# EAGLE design SparkFun_ProDriver_TC78H670FTG (EAGLE 9.6.2)
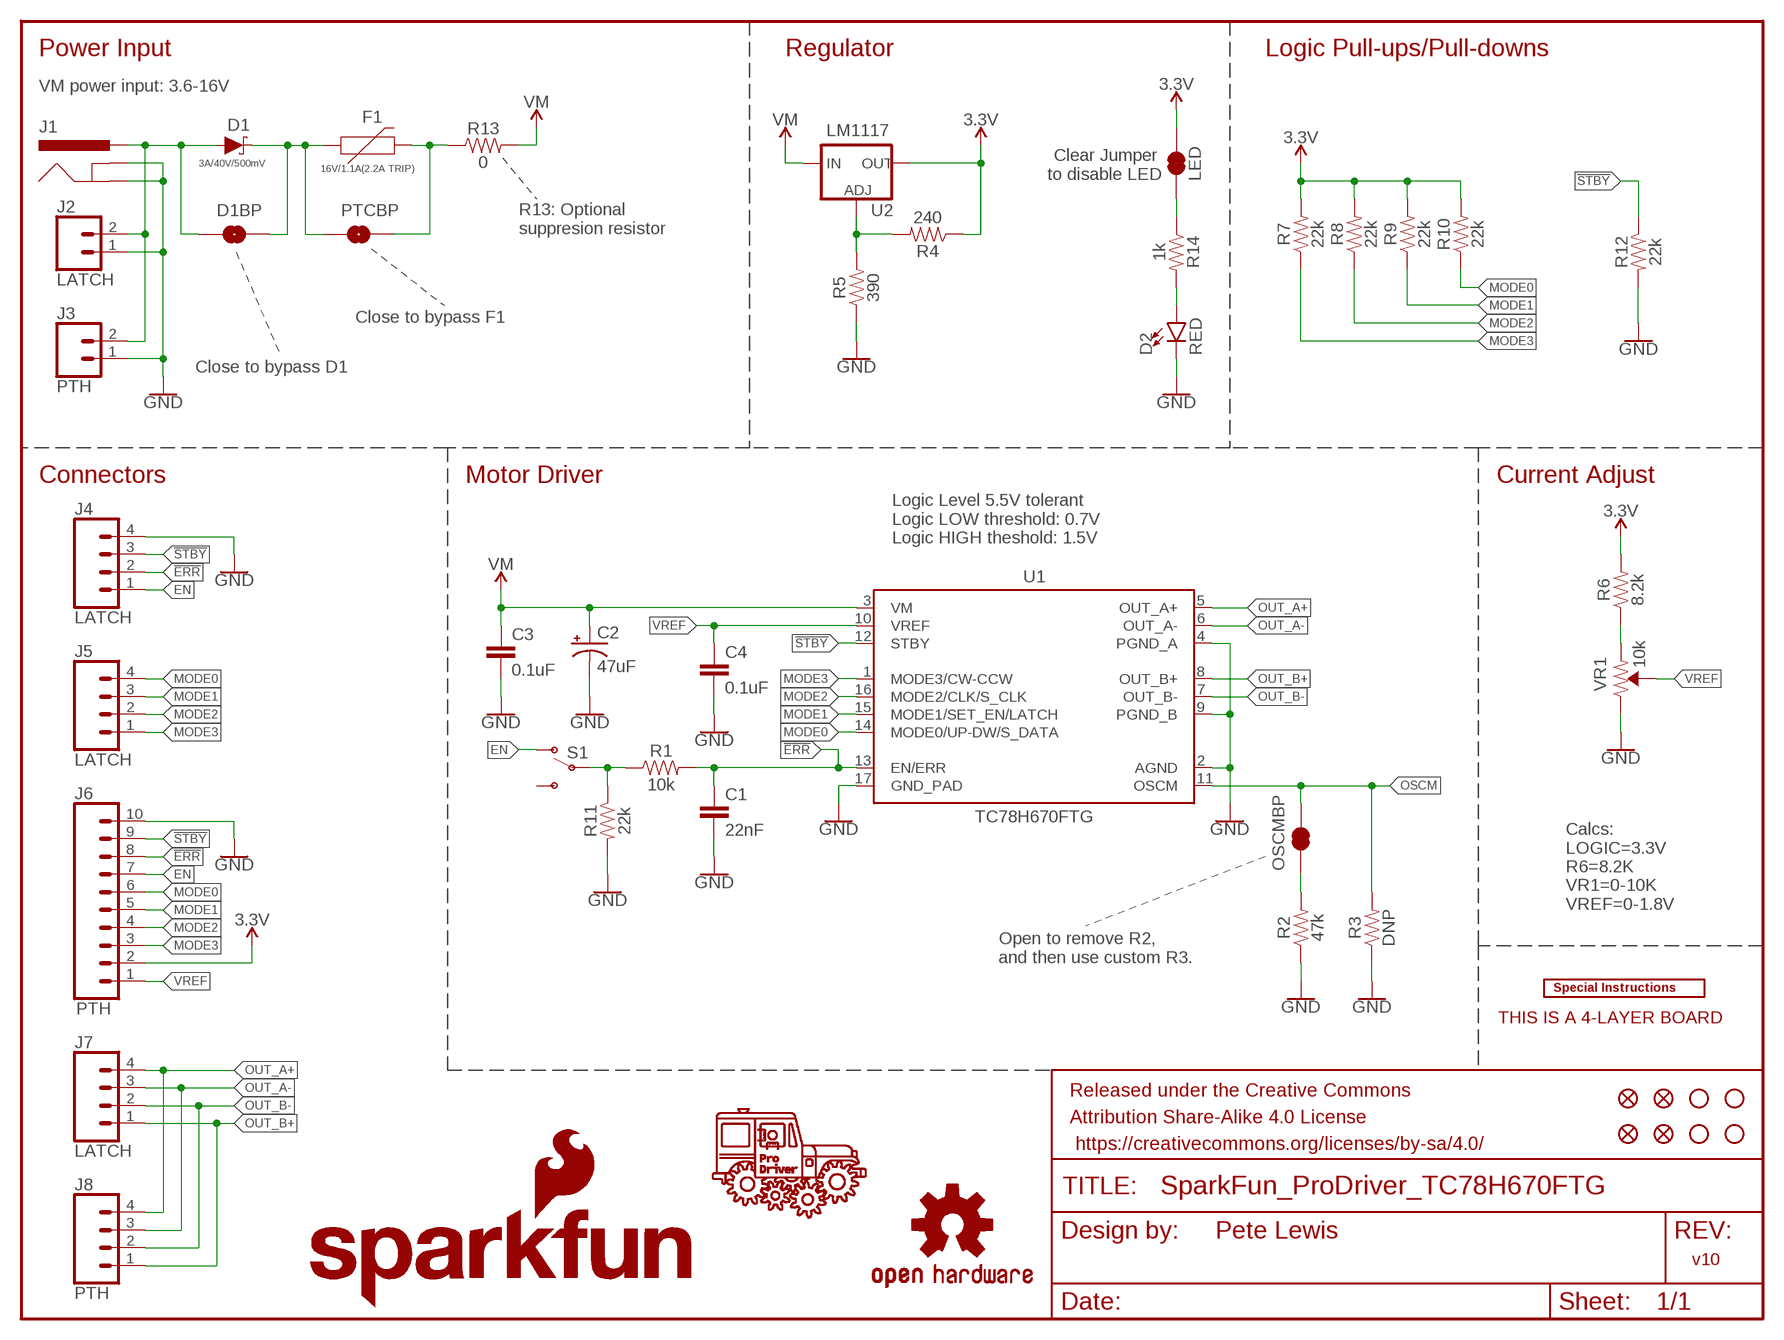
[diagram p0: schematic, sheet 1]

## Parts
C1  22nF  22NF/22,000PF-0603-50V-10%  [0603]
C2  47uF  47UF-POLAR-PANASONIC_D-35V-20%  [PANASONIC_D]
C3  0.1uF  0.1UF-0603-25V-(+80/-20%)  [0603]
C4  0.1uF  0.1UF-0603-25V-(+80/-20%)  [0603]
D1  3A/40V/500mV  DIODE-SCHOTTKY-B340A  [SMA-DIODE]
D1BP  JUMPER-SMT_2_NO_SILK  [SMT-JUMPER_2_NO_SILK]
D2  RED  LED-RED0603  [LED-0603]
F1  16V/1.1A(2.2A TRIP)  PPTC_16V_1.1A_(2.2ATRIP)  [1210]
FID1  FIDUCIAL1X2  [FIDUCIAL-1X2]
FID2  FIDUCIAL1X2  [FIDUCIAL-1X2]
FID3  FIDUCIAL1X2  [FIDUCIAL-1X2]
FID4  FIDUCIAL1X2  [FIDUCIAL-1X2]
FRAME1  FRAME-LETTER  [CREATIVE_COMMONS]
J1  POWER_JACKTOE  [POWER_JACK_SMD_OVERPASTE_TOE]
J2  LATCH  CONN_02LATCH_2  [LATCHTERMINAL-5MM-2]
J3  PTH  CONN_021X02_NO_SILK  [1X02_NO_SILK]
J4  LATCH  CONN_04LATCH  [LATCHTERMINAL-5MM-4]
J5  LATCH  CONN_04LATCH  [LATCHTERMINAL-5MM-4]
J6  PTH  CONN_10NO_SILK_PTH_FEMALE  [1X10_NO_SILK]
J7  LATCH  CONN_04LATCH  [LATCHTERMINAL-5MM-4]
J8  PTH  CONN_041X04_NO_SILK  [1X04_NO_SILK]
JP4  LED  JUMPER-SMT_2_NC_TRACE_SILK  [SMT-JUMPER_2_NC_TRACE_SILK]
LOGO1  SFE_LOGO_NAME_FLAME.1_INCH  [SFE_LOGO_NAME_FLAME_.1]
LOGO2  OSHW-LOGOS  [OSHW-LOGO-S]
LOGO3  SPECIAL_INSTRUCTIONS-ORDERING  [ORDERING_INSTRUCTIONS]
OSCMBP  JUMPER-SMT_2_NC_TRACE_SILK  [SMT-JUMPER_2_NC_TRACE_SILK]
PTCBP  JUMPER-SMT_2_NO_SILK  [SMT-JUMPER_2_NO_SILK]
R1  10k  10KOHM-0603-1/10W-1%  [0603]
R2  47k  47KOHM-0603-1/10W-1%  [0603]
R3  DNP  RESISTORAXIAL-0.3  [AXIAL-0.3]
R4  240  240OHM-0603-1/10W-1%  [0603]
R5  390  390OHM-0603-1/10W-1%  [0603]
R6  8.2k  8.2KOHM-0603-1/10W-5%  [0603]
R7  22k  22KOHM-0603-1/10W-1%  [0603]
R8  22k  22KOHM-0603-1/10W-1%  [0603]
R9  22k  22KOHM-0603-1/10W-1%  [0603]
R10  22k  22KOHM-0603-1/10W-1%  [0603]
R11  22k  22KOHM-0603-1/10W-1%  [0603]
R12  22k  22KOHM-0603-1/10W-1%  [0603]
R13  0  0OHM-0603-1/10W-5%  [0603]
R14  1k  1KOHM-0603-1/10W-1%  [0603]
S1  SWITCH-SPDT-PTH-11.6X4.0MM-LOCK  [SWITCH_SPDT_PTH_11.6X4.0MM_LOCK]
STANDOFF1  STAND-OFF  [STAND-OFF]
STANDOFF2  STAND-OFF  [STAND-OFF]
STANDOFF3  STAND-OFF  [STAND-OFF]
STANDOFF4  STAND-OFF  [STAND-OFF]
U1  TC78H670FTG  [P-VQFN16-0303-0.50-001]
U2  LM1117  V_REG_LM1117SOT223  [SOT223]
U$41  PRODRIVER_LOGO  [PRODRIVER_LOGO]
VR1  10k  TRIMPOT-SMD-3MM-CLOSED-1/8W-20%  [TRIMPOT-SMD-3MM-CLOSED]

## Nets
3.3V: J6.2 JP4.2 R4.1 R6.2 R7.2 R8.2 R9.2 R10.2 U2.2(OUT) U2.4(OUT)
!ERR: C1.1 J4.2 J6.8 R1.2 U1.13(EN/ERR)
!STBY: J4.3 J6.9 R12.1 U1.12(STBY)
EN: J4.1 J6.7 S1.1(O)
GND: C1.2 C2.- C3.2 C4.2 D2.C J1.GND(GNDBREAK) J1.P$4(GND) J2.1 J3.1 J4.4 J6.10 R2.1 R3.P$1 R5.1 R11.2 R12.2 U1.2(AGND) U1.4(PGND_A) U1.9(PGND_B) U1.17(GND_PAD) VR1.3(CW)
MODE0: J5.4 J6.6 R10.1 U1.14(MODE0/UP-DW/S_DATA)
MODE1: J5.3 J6.5 R9.1 U1.15(MODE1/SET_EN/LATCH)
MODE2: J5.2 J6.4 R8.1 U1.16(MODE2/CLK/S_CLK)
MODE3: J5.1 J6.3 R7.1 U1.1(MODE3/CW-CCW)
N$1: D1.C D1BP.2 F1.1 PTCBP.1
N$2: OSCMBP.1 R2.2
N$3: F1.2 PTCBP.2 R13.1
N$4: R4.2 R5.2 U2.1(ADJ)
N$5: R6.1 VR1.1(CCW)
N$6: D2.A R14.2
N$7: R1.1 R11.1 S1.2(P)
N$8: JP4.1 R14.1
OSCM: OSCMBP.2 R3.P$2 U1.11(OSCM)
OUT_A+: J7.4 J8.4 U1.5(OUT_A+)
OUT_A-: J7.3 J8.3 U1.6(OUT_A-)
OUT_B+: J7.1 J8.1 U1.8(OUT_B+)
OUT_B-: J7.2 J8.2 U1.7(OUT_B-)
RAW: D1.A D1BP.1 J1.VIN0(PWR) J2.2 J3.2
VM: C2.+ C3.1 R13.2 U1.3(VM) U2.3(IN)
VREF: C4.1 J6.1 U1.10(VREF) VR1.2(WIPER)
Unconnected: S1.3(S)

## Notes on the sheet
- Power Input | Regulator | Logic Pull-ups/Pull-downs
- VM power input: 3.6-16V
- Clear Jumper 
  to disable LED
- R13: Optional
  suppresion resistor
- Close to bypass F1
- Close to bypass D1
- Connectors | Motor Driver | Current Adjust
- Logic Level 5.5V tolerant
  Logic LOW threshold: 0.7V
  Logic HIGH theshold: 1.5V
- Calcs:
  LOGIC=3.3V
  R6=8.2K
  VR1=0-10K
  VREF=0-1.8V
- Open to remove R2,
  and then use custom R3.
- THIS IS A 4-LAYER BOARD
- Pete Lewis
- v10

## Library data of the parts
C1 = SparkFun-Capacitors:22NF/22,000PF: 0.022uF/22nF/22,000pF ceramic capacitors A capacitor is a passive two-terminal electrical component used to store electrical energy temporarily in an electric field.; PROD_ID: CAP-07885
C2 = SparkFun-Capacitors:47UF-POLAR: 47µF polarized capacitors A capacitor is a passive two-terminal electrical component used to store electrical energy temporarily in an electric field.; PROD_ID: CAP-08478
C3 C4 = SparkFun-Capacitors:0.1UF: 0.1µF ceramic capacitors A capacitor is a passive two-terminal electrical component used to store electrical energy temporarily in an electric field.; PROD_ID: CAP-00810
D1 = SparkFun-DiscreteSemi:DIODE-SCHOTTKY: Schottky diode A Schottky diode is a semiconductor diode which has a low forward voltage drop and a very fast switching action.; PROD_ID: DIO-09886
D1BP PTCBP = SparkFun-Jumpers:JUMPER-SMT_2_NO: Normally open jumper This jumper has two pads in close proximity to each other. Apply solder to close the connection. Round pads are easier to solder for beginners, but are a lot larger. SparkFun Product that uses the round pads: SparkFun EL Sequencer <https://www.sparkfun.com/products/12781>
D2 = SparkFun-LED:LED-RED: Red SMD LED Used in manufacturing of most products at SparkFun Packages: 0603 - SMD 0603 package [Product Link] <http://docs.avagotech.com/docs/AV02-0551EN> 0603 SMART - SMD 0603 SMART package ( more efficient and expensive)[Product Link] <http://www.osram-os.com/Graphics/XPic2/00077099_0.pdf> 1206 - SMD1206 package [Product Link] <https://www.sparkfun.com/datasheets/DevTools/LilyPad/Q150OVS4.pdff> SparkFun Products: Pro Mini 328 -5V <https://www.sparkfun.com/products/821> RedBoard <https://www.sparkfun.com/products/12757> IOIO-OTG <https://www.sparkfun.com/products/13613>; PROD_ID: DIO-00819
F1 = TC78H670FTG:PPTC: Resettable Fuse PPTC Resettable Fuse. Really a sort of resistor with a polymeric positive temperature coefficient whose resistance increases dramatically with an increase in temperature. When heated by the power passing through the resistance rises causing the current to be limited, protecting the circuit. This is achieved by the transition of the polymer from a crystalline to an amorphous state where the conductive carbon separates breaking the conductive pathways found in the cool crystalline structure. When a PPTC cools back down it resumes conducting letting the circuit turn back on. SparkFun Products: SparkFun RedBoard - Programmed with Arduino <https://www.sparkfun.com/products/12757> Pro Micro - 5V/16MHz <https://www.sparkfun.com/products/12640> Arduino Pro 328 - 5V/16MHz <https://www.sparkfun.com/products/10915> MP3 Trigger <https://www.sparkfun.com/products/13720>; PROD_ID: RES-15179
FID1-FID4 = SparkFun-Aesthetics:FIDUCIAL: Fiducial Alignment Points Point-of-reference for pick-and-place machines and other optical instruments.
FRAME1 = SparkFun-Aesthetics:FRAME-LETTER: Schematic Frame - Letter Standard 8.5x11 US Letter frame
J1 = SparkFun-Connectors:POWER_JACK: Power Jack Connector This is the standard 5.5mm barrel jack for power. The PTH is the most common, proven, reliable, footprint. The Slot footprint only works if the mill layer is transmitted to the PCB fab house so be warned. Here are the connectors we sell at SparkFun: DC Barrel Power Jack/Connector <https://www.sparkfun.com/products/119> (PRT-00119) DC Barrel Power Jack/Connector (SMD) <https://www.sparkfun.com/products/12748> (PRT-12748) DC Barrel Jack Adapter - Breadboard Compatible <https://www.sparkfun.com/products/10811> (PRT-10811) It is used on this SparkFun product (and many, many others): SparkFun RedBoard - Programmed with Arduino <https://www.sparkfun.com/products/12757> (DEV-12757) Also, if you need a mating power supply or connector, please check these out: Wall Adapter Power Supply - 9VDC 650mA <https://www.sparkfun.com/products/298> (TOL-00298) DC Barrel Jack Adapter - Male <https://www.sparkfun.com/products/10287> (PRT-10287); PROD_ID: CONN-08106; SF_ID: PRT-12748
J2 = SparkFun-Connectors:CONN_02: Multi connection point. Often used as Generic Header-pin footprint for 0.1 inch spaced/style header connections On any of the 0.1 inch spaced packages, you can populate with these: Break Away Headers - Straight <https://www.sparkfun.com/products/116> (PRT-00116) Break Away Male Headers - Right Angle <https://www.sparkfun.com/products/553> (PRT-00553) Female Headers <https://www.sparkfun.com/products/115> (PRT-00115) Break Away Headers - Machine Pin <https://www.sparkfun.com/products/117> (PRT-00117) Break Away Female Headers - Swiss Machine Pin <https://www.sparkfun.com/products/743> (PRT-00743) For SCREWTERMINALS and SPRING TERMINALS visit here: Screw Terimnals on SparkFun.com <https://www.sparkfun.com/search/results?term=Screw+Terminals> (5mm/3.5mm/2.54mm spacing) This device is also useful as a general connection point to wire up your design to another part of your project. Our various solder wires solder well into these plated through hole pads. Hook-Up Wire - Assortment (Stranded, 22 AWG) <https://www.sparkfun.com/products/11375> (PRT-11375) Hook-Up Wire - Assortment (Solid Core, 22 AWG) <https://www.sparkfun.com/products/11367> (PRT-11367) View the entire wire category on our website here <https://www.sparkfun.com/categories/141> Special notes: Molex polarized connector foot print use with: PRT-08233 with associated crimp pins and housings. 2.54_SCREWTERM for use with PRT-10571. 3.5mm Screw Terminal footprints for PRT-08084 5mm Screw Terminal footprints for use with PRT-08432; PROD_ID: CONN-14720; STOREFRONT_SKU: PRT-15898
J3 = SparkFun-Connectors:CONN_02: Multi connection point. Often used as Generic Header-pin footprint for 0.1 inch spaced/style header connections On any of the 0.1 inch spaced packages, you can populate with these: Break Away Headers - Straight <https://www.sparkfun.com/products/116> (PRT-00116) Break Away Male Headers - Right Angle <https://www.sparkfun.com/products/553> (PRT-00553) Female Headers <https://www.sparkfun.com/products/115> (PRT-00115) Break Away Headers - Machine Pin <https://www.sparkfun.com/products/117> (PRT-00117) Break Away Female Headers - Swiss Machine Pin <https://www.sparkfun.com/products/743> (PRT-00743) For SCREWTERMINALS and SPRING TERMINALS visit here: Screw Terimnals on SparkFun.com <https://www.sparkfun.com/search/results?term=Screw+Terminals> (5mm/3.5mm/2.54mm spacing) This device is also useful as a general connection point to wire up your design to another part of your project. Our various solder wires solder well into these plated through hole pads. Hook-Up Wire - Assortment (Stranded, 22 AWG) <https://www.sparkfun.com/products/11375> (PRT-11375) Hook-Up Wire - Assortment (Solid Core, 22 AWG) <https://www.sparkfun.com/products/11367> (PRT-11367) View the entire wire category on our website here <https://www.sparkfun.com/categories/141> Special notes: Molex polarized connector foot print use with: PRT-08233 with associated crimp pins and housings. 2.54_SCREWTERM for use with PRT-10571. 3.5mm Screw Terminal footprints for PRT-08084 5mm Screw Terminal footprints for use with PRT-08432
J4 J5 J7 = SparkFun-Connectors:CONN_04: Multi connection point. Often used as Generic Header-pin footprint for 0.1 inch spaced/style header connections On any of the 0.1 inch spaced packages, you can populate with these: Break Away Headers - Straight <https://www.sparkfun.com/products/116> (PRT-00116) Break Away Male Headers - Right Angle <https://www.sparkfun.com/products/553> (PRT-00553) Female Headers <https://www.sparkfun.com/products/115> (PRT-00115) Break Away Headers - Machine Pin <https://www.sparkfun.com/products/117> (PRT-00117) Break Away Female Headers - Swiss Machine Pin <https://www.sparkfun.com/products/743> (PRT-00743) For SCREWTERMINALS and SPRING TERMINALS visit here: Screw Terimnals on SparkFun.com <https://www.sparkfun.com/search/results?term=Screw+Terminals> (5mm/3.5mm/2.54mm spacing) This device is also useful as a general connection point to wire up your design to another part of your project. Our various solder wires solder well into these plated through hole pads. Hook-Up Wire - Assortment (Stranded, 22 AWG) <https://www.sparkfun.com/products/11375> (PRT-11375) Hook-Up Wire - Assortment (Solid Core, 22 AWG) <https://www.sparkfun.com/products/11367> (PRT-11367) View the entire wire category on our website here <https://www.sparkfun.com/categories/141> Special notes: Molex polarized connector foot print use with SKU : PRT-08231 with associated crimp pins and housings. 1MM SMD Version SKU: PRT-10208; PROD_ID: CONN-14722; STOREFRONT_SKU: PRT-15900
J6 = SparkFun-Connectors:CONN_10: Multi connection point. Often used as Generic Header-pin footprint for 0.1 inch spaced/style header connections On any of the 0.1 inch spaced packages, you can populate with these: Break Away Headers - Straight <https://www.sparkfun.com/products/116> (PRT-00116) Break Away Male Headers - Right Angle <https://www.sparkfun.com/products/553> (PRT-00553) Female Headers <https://www.sparkfun.com/products/115> (PRT-00115) Break Away Headers - Machine Pin <https://www.sparkfun.com/products/117> (PRT-00117) Break Away Female Headers - Swiss Machine Pin <https://www.sparkfun.com/products/743> (PRT-00743) Arduino Stackable Header - 10 Pin <https://www.sparkfun.com/products/11376> (PRT-11376) For SCREWTERMINALS and SPRING TERMINALS visit here: Screw Terimnals on SparkFun.com <https://www.sparkfun.com/search/results?term=Screw+Terminals> (5mm/3.5mm/2.54mm spacing) This device is also useful as a general connection point to wire up your design to another part of your project. Our various solder wires solder well into these plated through hole pads. Hook-Up Wire - Assortment (Stranded, 22 AWG) <https://www.sparkfun.com/products/11375> (PRT-11375) Hook-Up Wire - Assortment (Solid Core, 22 AWG) <https://www.sparkfun.com/products/11367> (PRT-11367) View the entire wire category on our website here <https://www.sparkfun.com/categories/141> Special notes: Molex polarized connector foot print use with SKU : PRT-08231 with associated crimp pins and housings. 1MM SMD Version SKU: PRT-10208 NOTES ON THE VARIANTS LOCK and LOCK_LONGPADS... This footprint was designed to help hold the alignment of a through-hole component (i.e. 6-pin header) while soldering it into place. You may notice that each hole has been shifted either up or down by 0.005 of an inch from it's more standard position (which is a perfectly straight line). This slight alteration caused the pins (the squares in the middle) to touch the edges of the holes. Because they are alternating, it causes a "brace" to hold the component in place. 0.005 has proven to be the perfect amount of "off-center" position when using our standard breakaway headers. Although looks a little odd when you look at the bare footprint, once you have a header in there, the alteration is very hard to notice. Also,if you push a header all the way into place, it is covered up entirely on the bottom side.
J8 = SparkFun-Connectors:CONN_04: Multi connection point. Often used as Generic Header-pin footprint for 0.1 inch spaced/style header connections On any of the 0.1 inch spaced packages, you can populate with these: Break Away Headers - Straight <https://www.sparkfun.com/products/116> (PRT-00116) Break Away Male Headers - Right Angle <https://www.sparkfun.com/products/553> (PRT-00553) Female Headers <https://www.sparkfun.com/products/115> (PRT-00115) Break Away Headers - Machine Pin <https://www.sparkfun.com/products/117> (PRT-00117) Break Away Female Headers - Swiss Machine Pin <https://www.sparkfun.com/products/743> (PRT-00743) For SCREWTERMINALS and SPRING TERMINALS visit here: Screw Terimnals on SparkFun.com <https://www.sparkfun.com/search/results?term=Screw+Terminals> (5mm/3.5mm/2.54mm spacing) This device is also useful as a general connection point to wire up your design to another part of your project. Our various solder wires solder well into these plated through hole pads. Hook-Up Wire - Assortment (Stranded, 22 AWG) <https://www.sparkfun.com/products/11375> (PRT-11375) Hook-Up Wire - Assortment (Solid Core, 22 AWG) <https://www.sparkfun.com/products/11367> (PRT-11367) View the entire wire category on our website here <https://www.sparkfun.com/categories/141> Special notes: Molex polarized connector foot print use with SKU : PRT-08231 with associated crimp pins and housings. 1MM SMD Version SKU: PRT-10208; PROD_ID: CONN-09696
JP4 OSCMBP = SparkFun-Jumpers:JUMPER-SMT_2_NC_TRACE: Normally closed trace jumper This jumper has a trace between two pads so it's normally closed (NC). Use a razor knife to open the connection. For best results follow the IPC guidelines for cutting traces: Cutout at least 0.063 mm (0.005 in). Remove all loose material to clean up the cut area. Seal the cut with an approved epoxy. Reapply solder to reclose the connection.
LOGO1 = SparkFun-Aesthetics:SFE_LOGO_NAME_FLAME: SparkFun Font Logo w/ Flame This is the SparkFun full logo. The logo on the schematic will always be the same size; the package variant is the height of the flame part of the logo. Default layer for the logo on the board is tSilk.
LOGO2 = SparkFun-Aesthetics:OSHW-LOGO: Open-Source Hardware (OSHW) Logo This logo indicates the piece of hardware it is found on incorporates a OSHW license and/or adheres to the definition of open source hardware found here: http://freedomdefined.org/OSHW
LOGO3 = SparkFun-Aesthetics:SPECIAL_INSTRUCTIONS: Special Ordering/Production Instructions Alert Symbol for special PCB ordering instructions or unique production process warnings. Ordering Instructions Production Instructions Types of information that should be added to box: Copper weight Soldermask color Silk color PCB thickness Number of layers PCB Standard: 1.6mm FR4 1 oz copper immersion silver plating red soldermask white silkscreen Types of information that should be added to box: Special wash requirements Depaneling instructions Humidification Glue curing Default text settings: 0.07 inch 9% ratio 50% line distance
R1 = SparkFun-Resistors:10KOHM: 10kΩ resistor A resistor is a passive two-terminal electrical component that implements electrical resistance as a circuit element. Resistors act to reduce current flow, and, at the same time, act to lower voltage levels within circuits. - Wikipedia; PROD_ID: RES-00824
R2 = SparkFun-Resistors:47KOHM: 47kΩ resistor A resistor is a passive two-terminal electrical component that implements electrical resistance as a circuit element. Resistors act to reduce current flow, and, at the same time, act to lower voltage levels within circuits. - Wikipedia; PROD_ID: RES-07871
R3 = SparkFun-Resistors:RESISTOR: Generic Resistor Package
R4 = SparkFun-Resistors:240OHM: 240Ω resistor A resistor is a passive two-terminal electrical component that implements electrical resistance as a circuit element. Resistors act to reduce current flow, and, at the same time, act to lower voltage levels within circuits. - Wikipedia; PROD_ID: RES-07849
R5 = SparkFun-Resistors:390OHM: 390Ω resistor A resistor is a passive two-terminal electrical component that implements electrical resistance as a circuit element. Resistors act to reduce current flow, and, at the same time, act to lower voltage levels within circuits. - Wikipedia; PROD_ID: RES-07864
R6 = SparkFun-Resistors:8.2KOHM: 8.2kΩ resistor A resistor is a passive two-terminal electrical component that implements electrical resistance as a circuit element. Resistors act to reduce current flow, and, at the same time, act to lower voltage levels within circuits. - Wikipedia; PROD_ID: RES-10646
R7-R12 = SparkFun-Resistors:22KOHM: 22kΩ resistor A resistor is a passive two-terminal electrical component that implements electrical resistance as a circuit element. Resistors act to reduce current flow, and, at the same time, act to lower voltage levels within circuits. - Wikipedia; PROD_ID: RES-07853
R13 = SparkFun-Resistors:0OHM: 0Ω resistor A resistor is a passive two-terminal electrical component that implements electrical resistance as a circuit element. Resistors act to reduce current flow, and, at the same time, act to lower voltage levels within circuits. - Wikipedia; PROD_ID: RES-08609
R14 = SparkFun-Resistors:1KOHM: 1kΩ resistor A resistor is a passive two-terminal electrical component that implements electrical resistance as a circuit element. Resistors act to reduce current flow, and, at the same time, act to lower voltage levels within circuits. - Wikipedia; PROD_ID: RES-07856
S1 = SparkFun-Switches:SWITCH-SPDT: Single Pole, Double Throw (SPDT) Switch Single-pole, double-throw (SPDT) switch. Variant Overview SMD-AYZ0202 Surface Mount DPDT Switch <https://www.sparkfun.com/products/597> (COM-00597) Used on e.g. LilyPad Arduino USB - ATmega32U4 Board <https://www.sparkfun.com/products/12049> PTH-11.6X4.0MM SPDT Mini Power Switch <https://www.sparkfun.com/products/102> (COM-00102) Used on e.g. SparkFun Simon Says - Through-Hole Soldering Kit <https://www.sparkfun.com/products/10547> (KIT-10547) PTH-11.6X4.0MM-KIT KIT version of SPDT Mini Power Switch - Simplifies soldering by removing tStop of switch pins - only one side can be soldered. PTH-11.6X4.0MM-LOCK LOCK version of SPDT Mini Power Switch - Offset pins hold switch in place for easier soldering. SMD-RIGHT-ANGLE Surface Mount Right Angle Switch <https://www.sparkfun.com/products/10860> (COM-10860) Used on e.g. SparkFun ESP8266 Thing <https://www.sparkfun.com/products/13231>; PROD_ID: SWCH-08261; SF_SKU: COM-00102
STANDOFF1-STANDOFF4 = SparkFun-Electromechanical:STAND-OFF: #4 Stand Off This is the mechanical footprint for a #4 phillips button head screw. Use the keepout ring to avoid running the screw head into surrounding components. SKU : PRT-00447
U1 = SparkFun-IC-Special-Function:TC78H670FTG: Toshiba TC78H670FTG Stepper Motor Driver Clock-in and Serial controlled Bipolar Stepping Motor Driver Datasheet <https://cdn.sparkfun.com/assets/9/9/6/d/1/TC78H670FTG_datasheet.pdf> SparkFun Products: SparkFun ProDriver - Stepper Motor Driver (TC78H670FTG) <https://www.sparkfun.com/products/16836> <https://www.sparkfun.com/products/16836>; PROD_ID: IC-15170
U2 = SparkFun-IC-Power:V_REG_LM1117: Voltage Regulator LM1117 Standard adjustable voltage regulator but in SMD form. Spark Fun Electronics SKU : COM-00595; PROD_ID: VREG-08170
U$41 = TC78H670FTG:PRODRIVER_LOGO
VR1 = SparkFun-Resistors:TRIMPOT: Trimming Potentiometer (Trimpot) Three-terminal potentiometers, with an adjustable wiper and two adjustable resistors. A pot can be used to create a configurable voltage divider, or as a variable resistor. "Trimpots" are a subset of potentiometers, usually intended for "set-and-forget" applications. They're often more delicate than standard potentiometers - rated for fewer turns. Variants PTH-KNOB - PTH Trimpot w/ finger-adjustable knob Trimpot 10K with Knob <https://www.sparkfun.com/products/9806> (COM-09806) Datasheet <http://www.sparkfun.com/datasheets/Components/General/TSR-3386.pdf> SMD-3MM-CLOSED-FRAME - SMD 3mm Square Closed-Frame Trimpot Used on e.g. EasyDriver - Stepper Motor Driver <https://www.sparkfun.com/products/12779> Datasheet <http://www.bitechnologies.com/pdfs/22.pdf> (22AR10KTR) SMD-5MM - SMD 5mm Square Closed-Frame Trimpot Used on e.g. IOIO-OTG - V2.2 <https://www.sparkfun.com/products/13613> Datasheet <http://www.vishay.com/docs/51008/ts53.pdf> (TS53YL502MR10) SMD-3MM-1/10W-25% - 3mm Square Open-Frame Trimpot Used on e.g. SparkFun Shapeoko <https://www.sparkfun.com/products/13899> Datasheet <http://www.bourns.com/docs/Product-Datasheets/TC33.pdf> (TC33X-2-103E); PROD_ID: RES-09285

## Net classes
1 power: width 0.203 mm

## Board
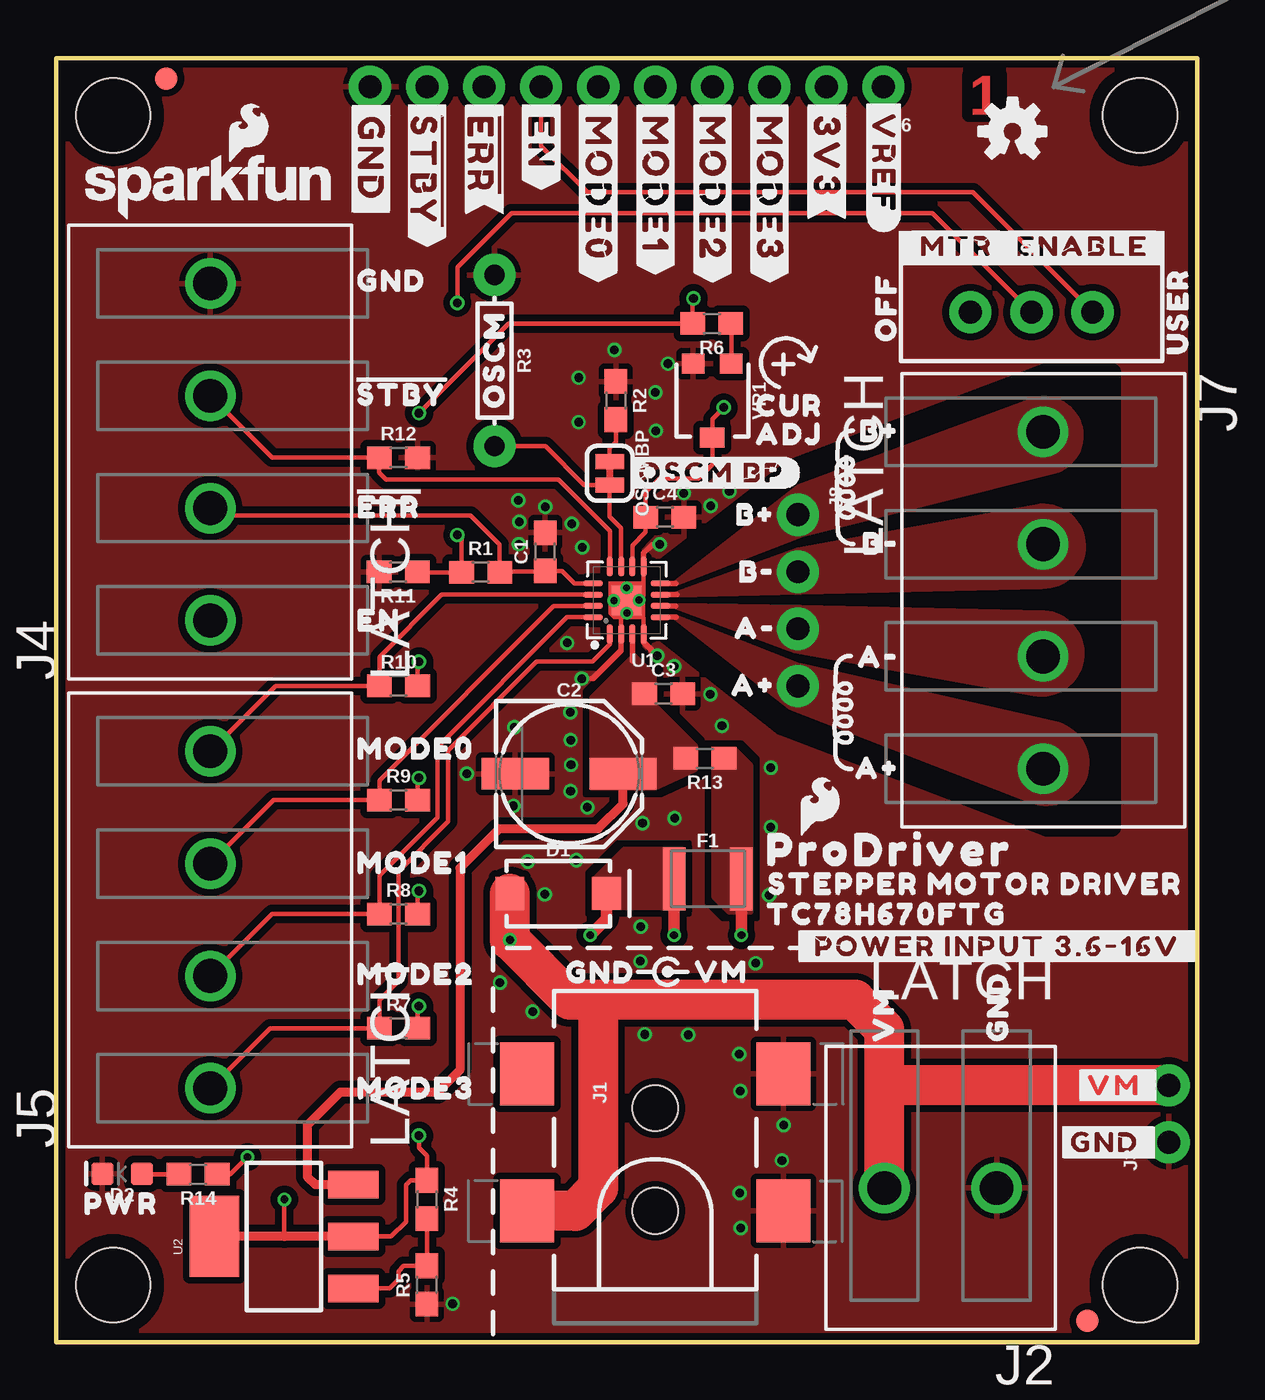
[diagram p1: board, top side]
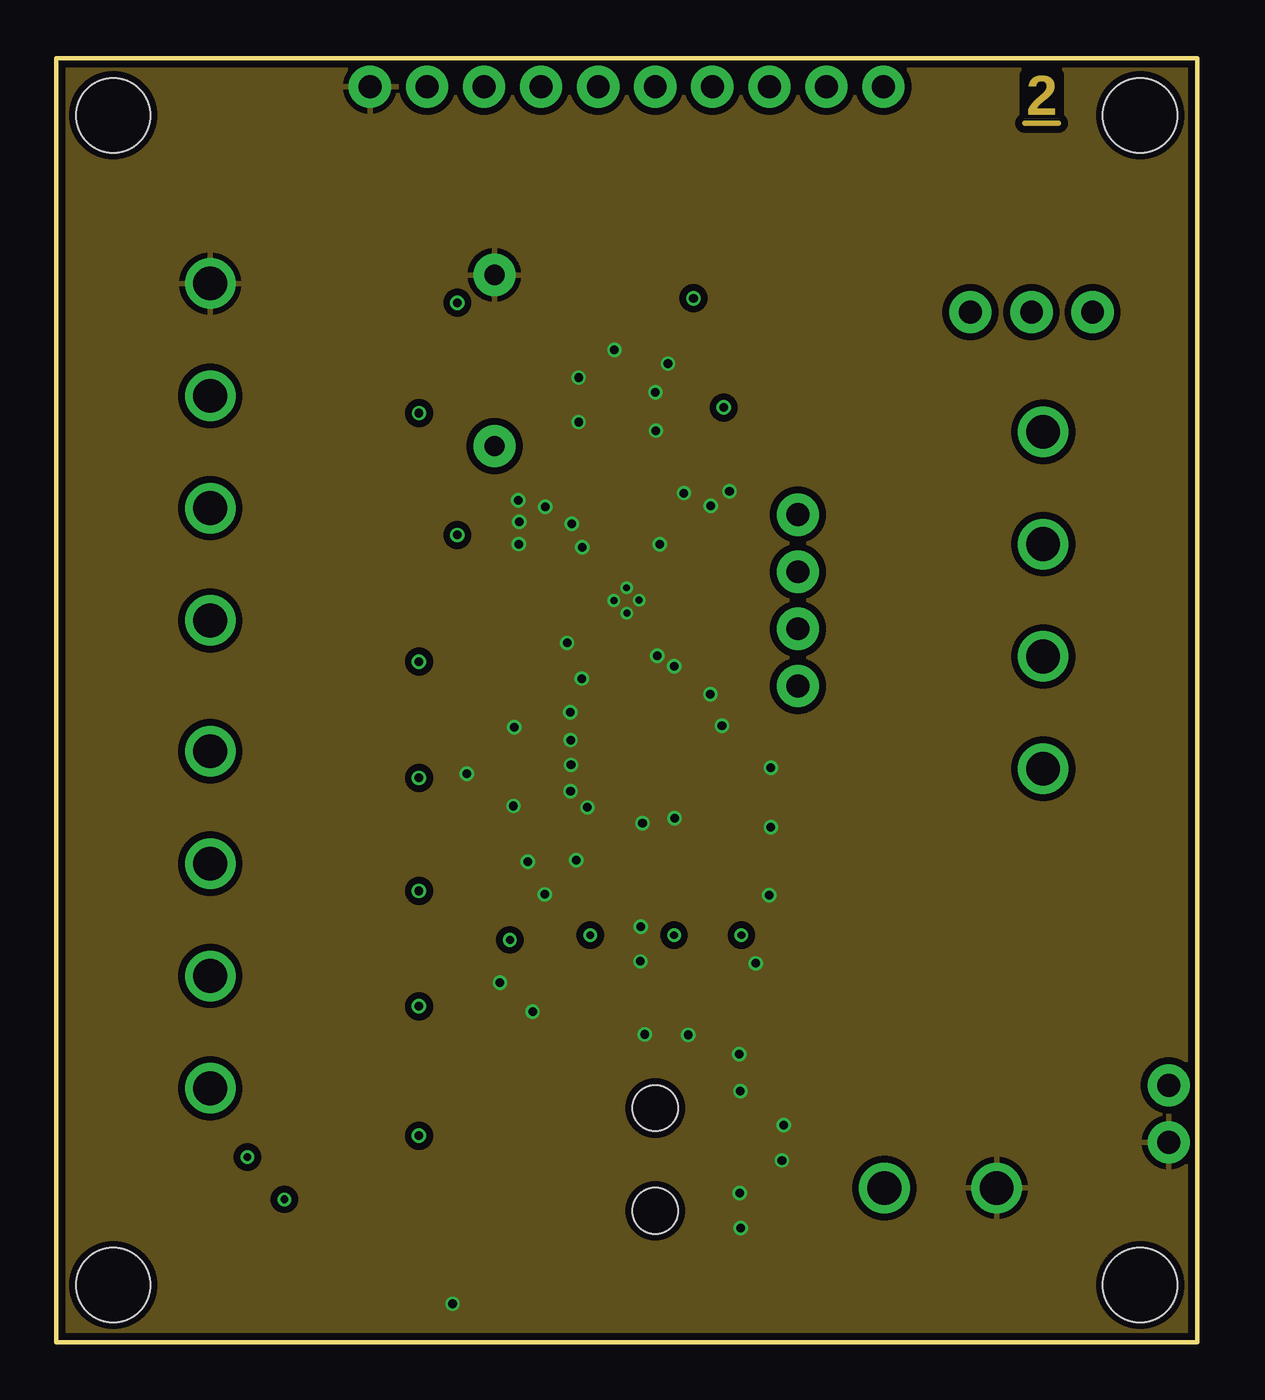
[diagram p2: board, inner layer GND2]
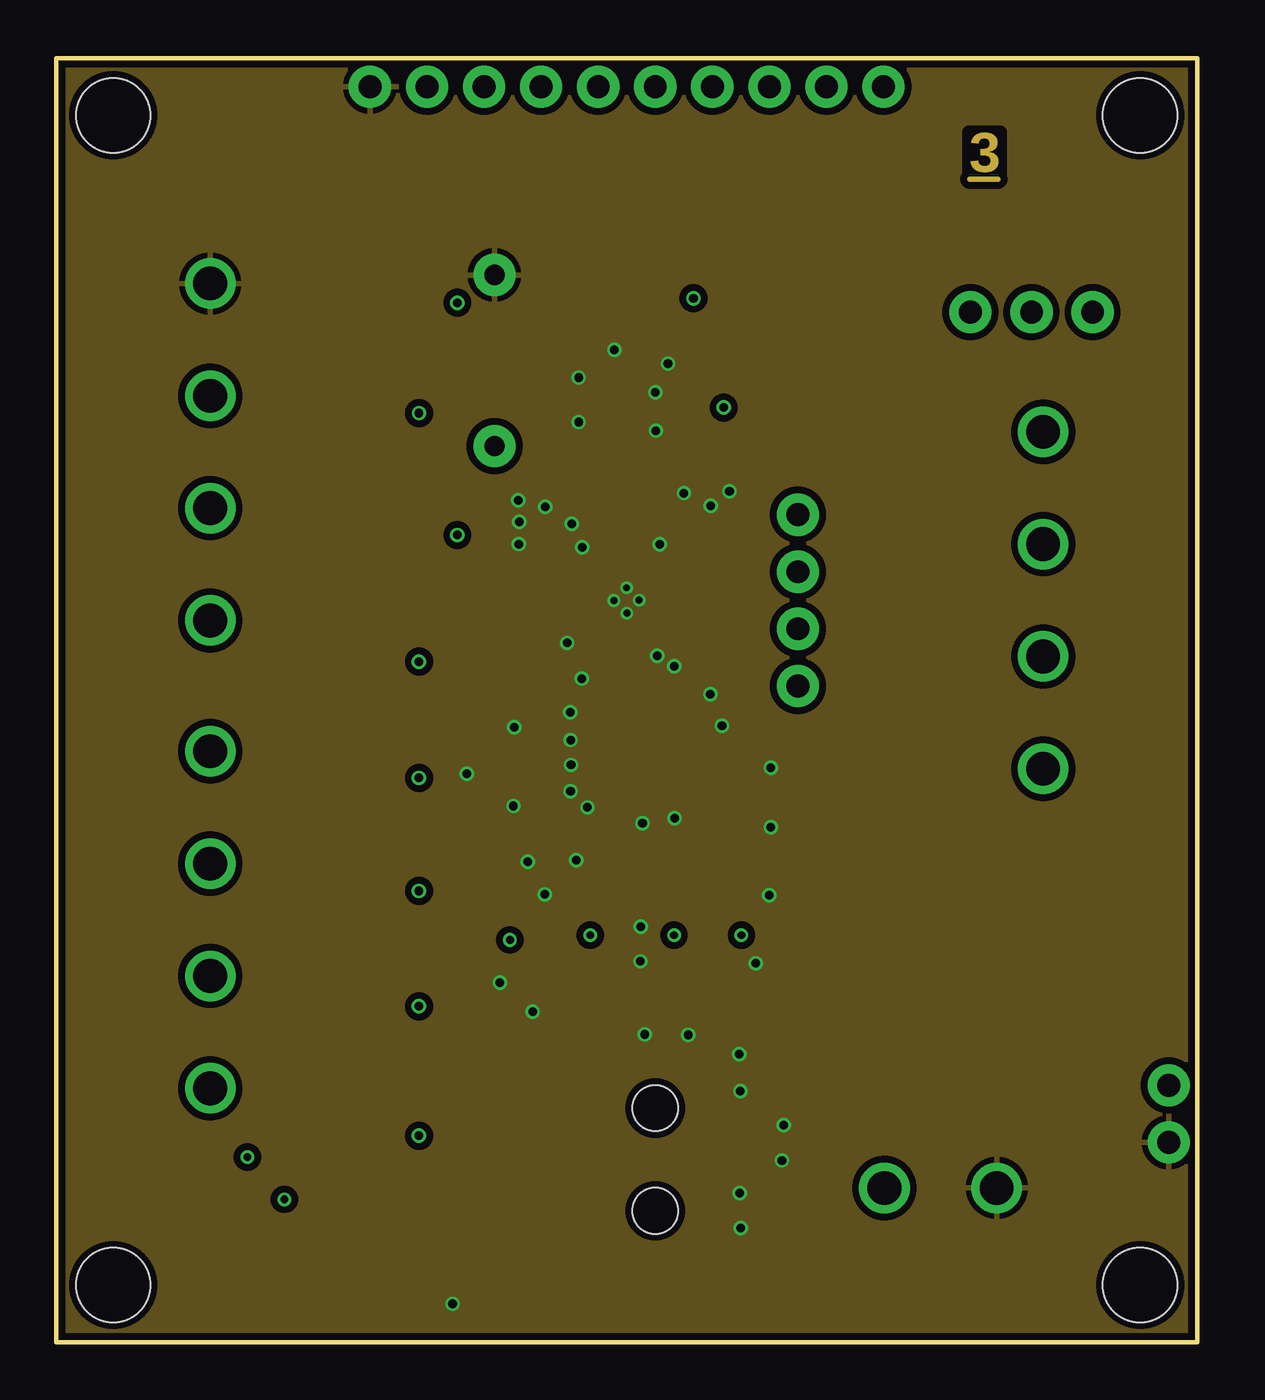
[diagram p3: board, inner layer GND15]
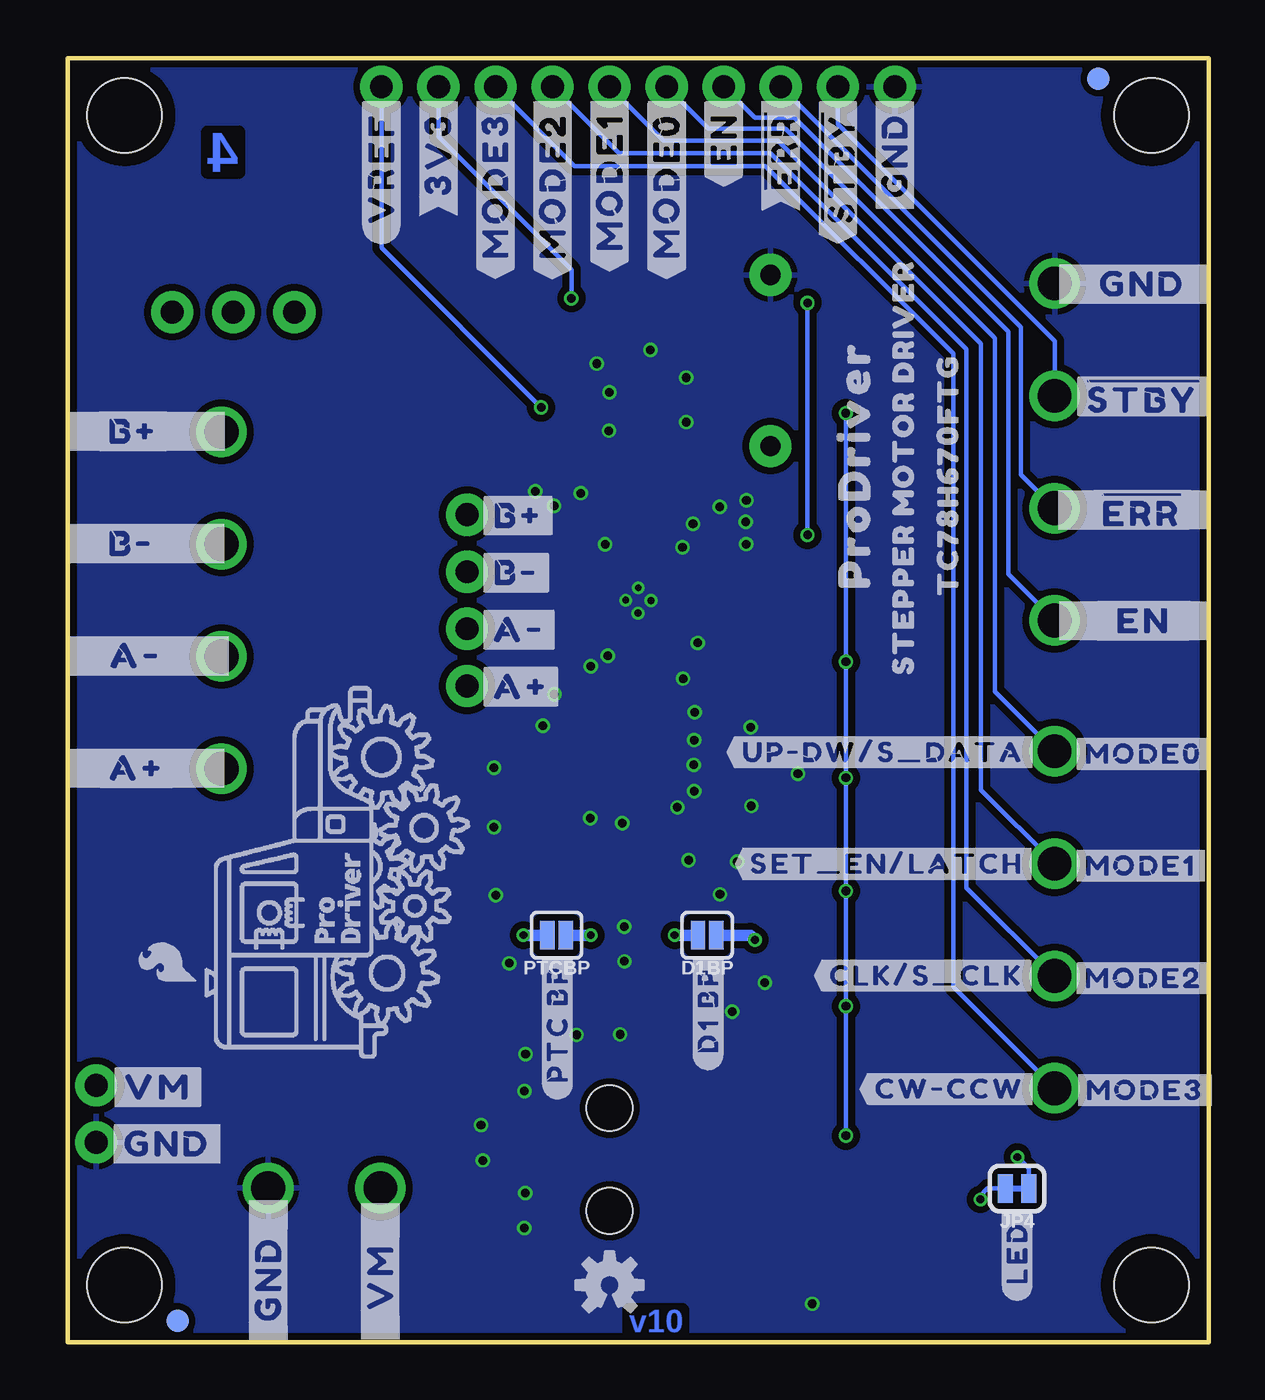
[diagram p4: board, bottom side, seen from below]

Size 50.8 x 57.15 mm. Coordinates in mm from the lower left corner, seen from the top.
Outline: 50.8,57.15 50.8,0 0,0 0,57.15 50.8,57.15
Copper layers (1*2*15*16): Top 0.035559375mm / dielectric 0.47751875mm / GND2 0.035559375mm / dielectric 0.47751875mm / GND15 0.035559375mm / dielectric 0.47751875mm / Bottom 0.035559375mm
Design rules "SparkFun-4-layer-FAB-LIMIT": minimum track width 4mil, minimum drill 6mil, track to track 5mil, track to pad 5mil, pad to pad 5mil, via to via 5mil, smd to smd 5mil, copper to edge 4mil, drill to drill 4mil, minimum pad ring 5mil, minimum via ring 5mil, stop-mask expansion 4mil, vias tented up to drill 25mil, thermal gap 10mil
tRestrict: area 26.5,31.4 to 26.5,31.6; area 26.5,34.5 to 26.5,34.6; 7 lines

### Footprints (pad centres in the part's own frame; a part is rotated, then mirrored left to right if it is on the bottom)
0603 = smd 1.1 x 1: 1 -0.85,0; 2 0.85,0
PANASONIC_D = smd 3 x 1.4: + 2.4,0; - -2.4,0
SMA-DIODE = smd 1.27 x 1.47: A -2.15,0; C 2.15,0
SMT-JUMPER_2_NO_SILK = smd 0.635 x 1.27: 1 -0.406,0; 2 0.406,0
LED-0603 = smd 1 x 1: A -0.877,0; C 0.877,0
1210 = smd 1 x 2.8: 1 -1.5,0; 2 1.5,0
FIDUCIAL-1X2 = smd 1 x 1: 1 0,0
POWER_JACK_SMD_OVERPASTE_TOE = smd 2.8 x 2.4: GND 0,-5.7; P$4 6.1,-5.7; VIN0 0,5.7; VIN1 6.1,5.7 | hole 2.032: 0,0; 4.572,0
LATCHTERMINAL-5MM-2 = drill 1.5: 1 -2.5,0; 2 2.5,0
1X02_NO_SILK = drill 1.016 pad 1.88: 1 0,0; 2 2.54,0
LATCHTERMINAL-5MM-4 = drill 1.5: 1 -7.5,0; 2 -2.5,0; 3 2.5,0; 4 7.5,0
1X10_NO_SILK = drill 1.016 pad 1.88: 1 0,0; 2 2.54,0; 3 5.08,0; 4 7.62,0; 5 10.16,0; 6 12.7,0; 7 15.24,0; 8 17.78,0; 9 20.32,0; 10 22.86,0
1X04_NO_SILK = drill 1.016 pad 1.88: 1 0,0; 2 2.54,0; 3 5.08,0; 4 7.62,0
SMT-JUMPER_2_NC_TRACE_SILK = smd 0.66 x 1.27: 1 -0.521,0; 2 0.521,0
AXIAL-0.3 = drill 0.9 pad 1.88: P$1 -3.81,0; P$2 3.81,0
SWITCH_SPDT_PTH_11.6X4.0MM_LOCK = drill 1.016 pad 1.88: 1 0,2.718; 2 0,0; 3 0,-2.718
STAND-OFF = hole 3.302: 0,0
P-VQFN16-0303-0.50-001 = smd 0.255 x 0.85: 1 0.75,1.498; 2 0.25,1.498; 3 -0.25,1.498; 4 -0.75,1.498; 9 -0.75,-1.506; 10 -0.25,-1.506; 11 0.25,-1.506; 12 0.75,-1.506 | smd 0.85 x 0.255: 5 -1.508,0.75; 6 -1.5,0.25; 7 -1.508,-0.25; 8 -1.508,-0.75; 13 1.496,-0.75; 14 1.496,-0.25; 15 1.496,0.25; 16 1.496,0.75 | smd 1.3 x 1.3: 17 0,0
SOT223 = smd 1.219 x 2.235: 1 -2.311,-3.099; 2 0,-3.099; 3 2.311,-3.099 | smd 3.6 x 2.2: 4 0,3.099
TRIMPOT-SMD-3MM-CLOSED = smd 1 x 0.9: 1 -0.85,-1.65; 3 0.85,-1.65 | smd 1.1 x 0.9: 2 0,1.65

### Placement (x,y rotation side)
C1  21.77,35.18 90 top
C2  22.83,25.29 0 top
C3  27.04,28.85 0 top
C4  27.09,36.72 0 top
D1  22.35,19.96 0 top
D1BP  22.33,18.11 180 bottom
D2  2.94,7.49 180 top
F1  29.01,20.62 0 top
FID1  4.9,56.24 90 top
FID2  45.91,0.94 90 top
FID3  4.9,56.24 0 bottom
FID4  45.91,0.94 0 bottom
FRAME1  -2.54,-16.51 0 top  (outside the outline)
J1  26.67,5.84 90 top
J2  39.37,6.86 180 top
J3  49.53,8.89 90 top
J4  6.86,39.62 90 top
J5  6.86,18.8 90 top
J6  36.83,55.88 180 top
J7  43.94,33.02 270 top
J8  33.02,36.83 270 top
JP4  8.53,6.84 180 bottom
LOGO1  6.84,51.44 0 top
LOGO2  42.58,53.89 0 top
LOGO3  -22.86,-17.78 0 top  (outside the outline)
LOGO5  SFE_LOGO_NAME_FLAME.1_INCH  [SFE_LOGO_FLAME_.1]  46.38,16.9 90 bottom
LOGO6  SFE_LOGO_FLAME.1_INCH  [SFE_LOGO_FLAME_.1]  33.99,23.86 0 top
OSCMBP  24.64,38.68 270 top
PTCBP  29.03,18.11 180 bottom
R1  18.9,34.26 0 top
R2  24.91,41.91 270 top
R3  19.51,43.69 270 top
R4  16.51,6.35 270 top
R5  16.51,2.54 90 top
R6  29.18,45.34 180 top
R7  15.24,13.97 0 top
R8  15.24,19.05 0 top
R9  15.24,24.13 0 top
R10  15.24,29.21 0 top
R11  15.23,34.28 180 top
R12  15.24,39.37 0 top
R13  28.88,25.98 180 top
R14  6.32,7.48 180 top
S1  43.42,45.84 270 top
STANDOFF1  2.54,54.61 90 top
STANDOFF2  48.26,54.61 90 top
STANDOFF3  48.26,2.54 90 top
STANDOFF4  2.54,2.54 90 top
U1  25.4,33.02 180 top
U2  10.13,4.7 90 top
U$1  [A#2]  38.21,25.55 0 top
U$2  [B#0]  38.2,35.54 0 top
U$3  [B#1]  38.2,40.56 0 top
U$4  [A#3]  38.2,30.5 0 top
U$5  [GND6]  12.7,47.24 0 top
U$6  [TC78H670FTG0]  30.93,19.05 0 top
U$7  [USER0]  49.92,43.28 90 top
U$8  [#ERR#3]  12.71,37.31 0 top
U$9  [STEPPER_MOTOR_DRIVER0]  31,20.39 0 top
U$10  [CUR0]  30.45,41.68 0 top
U$11  [VM10]  36.83,12.7 90 top
U$12  [GND6]  41.91,12.7 90 top
U$13  [#EN#2]  21.6,55.48 270 top
U$14  [#MTR#0]  37.76,48.78 0 top
U$15  [B#1]  32.68,36.84 0 top
U$16  [#OSCM_BP#0]  25.23,38.7 0 top
U$17  [OFF0]  36.94,43.86 90 top
U$18  [OSCM0]  19.5,40.91 90 top
U$19  [EN0]  12.7,32.13 0 top
U$20  [ADJ0]  30.45,40.41 0 top
U$21  [#ENABLE#0]  42.05,48.78 0 top
U$22  [CURRENT_ADJUST]  31.29,42.39 0 top
U$23  [MODE30]  12.7,11.3 0 top
U$24  [MODE10]  12.7,21.34 0 top
U$25  [MODE20]  12.7,16.38 0 top
U$26  [MODE00]  12.7,26.42 0 top
U$27  [#GND_#0]  44.45,8.89 0 top
U$28  [#VM_#0]  45.21,11.43 0 top
U$29  [GND6]  22,16.46 0 top
U$30  [VM10]  27.74,16.48 0 top
U$31  [#GND#0]  14.01,52.67 270 top
U$32  [#VREF#0]  36.84,55.48 270 top
U$33  [#MODE0#4]  24.14,55.48 270 top
U$34  [##ERR##5]  5.62,37.05 0 bottom
U$35  [##ERR##5]  19.06,55.48 270 top
U$36  [#_POWER_INPUT_3#6#16V_#0]  32.72,17.61 0 top
U$37  [#B##0]  49.85,40.54 0 bottom
U$38  [#LED#10]  8.53,6.07 90 bottom
U$40  [PRODRIVER0]  30.56,21.92 0 top
U$41  39.24,20.7 90 bottom
U$42  [B#0]  32.7,34.3 0 top
U$43  [A#3]  32.72,31.78 0 top
U$44  [A#2]  32.69,29.24 0 top
U$46  [#MODE1#4]  26.68,55.48 270 top
U$47  [#MODE2#4]  29.22,55.48 270 top
U$48  [#MODE3#4]  31.76,55.48 270 top
U$49  [#B##1]  49.85,35.54 0 bottom
U$50  [#A##2]  49.77,30.54 0 bottom
U$51  [#A##3]  49.81,25.54 0 bottom
U$52  [#GND#5]  2.95,47.1 0 bottom
U$53  [##STBY##1]  16.52,55.48 270 top
U$54  [##STBY##7]  16.51,55.63 90 bottom
U$55  [#_EN_#0]  2.9,32.11 0 bottom
U$56  [#B##0]  32.71,36.79 0 bottom
U$57  [#B##1]  32.71,34.25 0 bottom
U$58  [#A##2]  32.71,31.71 0 bottom
U$59  [#A##3]  32.71,29.17 0 bottom
U$60  [#MODE0#0]  2.9,26.18 0 bottom
U$61  [#MODE1#0]  3.02,21.21 0 bottom
U$62  [#MODE2#0]  2.89,16.2 0 bottom
U$63  [#MODE3#0]  2.83,11.21 0 bottom
U$64  [#D1_BP#10]  22.29,17.4 90 bottom
U$65  [#CLK#S_CLK#0]  12.57,16.31 0 bottom
U$66  [#SET_EN#LATCH#0]  14.33,21.28 0 bottom
U$67  [#UP#DW#S_DATA#0]  14.49,26.25 0 bottom
U$68  [#VM#0]  46.78,11.35 0 bottom
U$69  [#GND#0]  46.37,8.82 0 bottom
U$70  [#PTC_BP#9]  28.99,17.49 90 bottom
U$71  [OSHW-LOGO-S]  26.67,2.54 0 bottom
U$72  [#VM#0]  36.88,2.91 90 bottom
U$73  [#GND#0]  41.86,2.82 90 bottom
U$74  [#MODE0#1]  24.13,55.63 90 bottom
U$75  [#3V3#4]  34.3,55.48 270 top
U$80  [#VREF#4]  36.83,55.63 90 bottom
U$82  [#CW#CCW#0]  11.53,11.26 0 bottom
U$83  [PWR0]  0.53,6.16 0 top
U$84  [TC78H670FTG0]  11.61,32.57 90 bottom
U$85  [STEPPER_MOTOR_DRIVER0]  13.59,29.04 90 bottom
U$86  [PRODRIVER0]  15.77,32.52 90 bottom
U$87  [##STBY##0]  6.28,42.1 0 bottom
U$89  [#STBY#2]  12.71,42.31 0 top
U$90  [#MODE1#1]  26.67,55.63 90 bottom
U$91  [#MODE2#2]  29.21,55.63 90 bottom
U$92  [#MODE3#3]  31.75,55.63 90 bottom
U$93  [#3V3#4]  34.29,55.63 90 bottom
U$94  [#EN#5]  21.59,55.63 90 bottom
U$95  [##ERR##6]  19.05,55.63 90 bottom
U$96  [#GND#8]  13.97,55.63 90 bottom
VR1  29.21,41.91 180 top

### Tracks (layer width: path | path; a pad name or v marks a point on that pad's centre or on a via)
3.3V  (via drill 0.35, 0.38)
  Top 0.203: U2.2 14.92,4.7 15.58,5.36 15.58,7.01 15.77,7.2 R4.1 16.51,8.29 16.15,8.65 v16.15,9.19 | R10.2 16.09,30.23 v16.15,30.29 | R9.2 16.09,25.05 v16.15,25.11 | R8.2 16.09,20.02 v16.15,20.08 | R7.2 16.09,14.89 v16.15,14.95 | v16.15,41.35 20.14,45.34 R6.2 28.34,46.43 v28.37,46.46 | v10.16,6.35 10.16,4.7
  Top 0.406: U2.2 10.16,4.7 U2.4
  Bottom 0.203: v16.15,9.19 v16.15,14.95 v16.15,20.08 v16.15,25.11 v16.15,30.29 v16.15,41.35 | v28.37,46.46 28.37,47.73 34.29,53.65 J6.2 | JP4.2 9.84,6.83 10.16,6.52 v10.16,6.35
!ERR
  Top 0.203: U1.13 23.07,33.77 22.51,34.33 C1.1 21.73,34.29 19.75,34.29 | R1.2 19.75,34.29 | 19.75,34.29 19.75,35.5 18.45,36.8 7.18,36.8 J4.2
  Bottom 0.203: J6.8 8.36,45.19 8.36,38.62 J4.2
!STBY
  Top 0.203: U1.12 24.65,36.11 22.36,38.4 14.68,38.4 14.39,38.69 R12.1 9.61,39.37 J4.3
  Bottom 0.203: J4.3 6.86,44.55 16.51,54.2 J6.9
EN
  Top 0.203: J6.7 21.59,53.24 23.65,51.18 40.8,51.18 S1.1
  Bottom 0.203: J6.7 20.2,54.49 18.43,54.49 8.92,44.98 8.92,34.19 J4.1
GND  (via drill 0.3, 0.38)
  Top 0.203: v25.95,33.02 26.15,33.22 U1.9 | v26.87,35.51 26.54,35.51 | v25.41,32.45 25.94,32.45 26.15,32.24 U1.4 26.15,31.16 | U1.17 25.15,32.77 U1.2 | v23.4,29.54 23.89,29.54
  Top 0.254: 26.54,35.51 26.15,35.12 U1.9 | v26.76,30.55 26.15,31.16 | 23.89,29.54 25.15,30.79 U1.2
  other vias: 18.29,25.3 25.4,33.57 24.83,33.01 21.77,37.18 20.39,27.37 20.36,23.87 29.12,28.84 30.46,11.17 30.41,12.82 32.39,9.66 30.47,5.07 30.43,6.63 32.31,8.08 17.65,1.7 24.85,44.17 27.24,43.56 29.14,37.23 23.43,35.38 22.75,31.12 22.88,28.04 22.9,26.8 22.92,25.69 22.9,24.52 23.65,23.8 27.51,30.08 20.59,35.52 20.61,36.52 20.58,37.47 22.96,36.42 27.95,37.79 29.97,37.87 26.01,16.95 31.14,16.86 28.14,13.67 26.21,13.7 19.76,16 21.21,14.71 26.68,42.28 26.7,40.57 23.26,40.95 23.26,42.93 27.53,23.32 26.1,23.1 23.16,21.45 20.99,21.38 21.76,19.93 26.02,18.49 31.74,19.89 31.82,22.92 31.82,25.57 29.64,27.44
  pour Top (isolate 0.305, rank 6): 0,57.15 0,0 50.8,0 50.8,57.15
  pour Bottom (isolate 0.305, rank 6): 0,57.15 0,0 50.8,0 50.8,57.15
  pour GND15 (isolate 0.305): 0,0 0,57.15 50.8,57.15 50.8,0
  pour GND2 (isolate 0.305): 0,0 0,57.15 50.8,57.15 50.8,0
MODE0
  Top 0.203: U1.14 17.17,33.27 14.39,30.49 R10.1 9.77,29.21 J5.4
  Bottom 0.203: J6.6 22.26,54.01 18.83,54.01 9.52,44.69 9.52,28.95 J5.4
MODE1
  Top 0.203: U1.15 22.15,32.77 14.39,25.01 R9.1 9.69,24.13 J5.3
  Bottom 0.203: J6.5 24.28,53.49 19.18,53.49 10.14,44.45 10.14,24.57 J5.3
MODE2
  Top 0.203: U1.16 22.74,32.27 16.97,26.5 16.97,23.36 14.39,20.78 R8.1 9.61,19.05 J5.2
  Bottom 0.203: J6.4 26.26,52.93 19.5,52.93 10.79,44.21 10.79,20.23 J5.2
MODE3
  Top 0.203: U1.1 24.65,31.06 23.87,30.28 21.39,30.28 17.45,26.34 17.45,23.17 15.24,20.95 15.24,16.08 14.39,15.23 R7.1 9.53,13.97 J5.1
  Bottom 0.203: J6.3 28.22,52.35 19.73,52.35 11.37,43.99 11.37,15.8 J5.1
N$1  (via drill 0.35)
  Top 0.508: F1.1 v27.51,18.11 | D1.C 24.5,18.84 v23.77,18.11
  Bottom 0.508: v27.51,18.11 PTCBP.1 | v23.77,18.11 D1BP.2
  pour Top (no thermals): 27.91,21.95 25.27,21.95 23.95,20.62 23.95,19.33 27.91,19.33
N$2
  Top 0.203: OSCMBP.1 24.64,39.79 24.91,40.07 R2.2
N$3  (via drill 0.35)
  Top 0.508: F1.2 v30.51,18.11 v30.5,18.11
  Bottom 0.508: v30.5,18.11 PTCBP.2
  pour Top (no thermals): 29.26,26.39 29.26,19.81 29.95,19.13 30.94,19.13 30.94,25.68 30.23,26.39
N$4
  Top 0.203: U2.1 14.84,2.39 15.24,2.79 15.24,3.15 15.47,3.39 R5.2 R4.2
N$5
  Top 0.203: VR1.1 30.06,45.31 R6.1
N$6
  Top 0.203: R14.2 3.83,7.47 D2.A
N$7  (via drill 0.38)
  Top 0.203: R11.1 16.1,34.27 R1.1 18.05,35.74 v17.86,35.93 | v17.86,46.26 17.86,47.85 20.27,50.26 39,50.26 S1.2
  Bottom 0.203: v17.86,35.93 v17.86,46.26
N$8  (via drill 0.35)
  Top 0.203: v8.51,8.23 7.75,7.47 R14.1
  Bottom 0.203: JP4.1 8.01,7.73 v8.51,8.23
N$9
  GND2 0.254: 43.12,54.25 44.62,54.25
N$12
  GND15 0.254: 40.67,51.76 41.93,51.76
OSCM
  Top 0.203: U1.11 25.15,36.24 24.64,36.75 OSCMBP.2 23.5,38.16 21.77,39.88 R3.P$2
OUT_A+
  Top 0.254: U1.5 27.58,32.27
  pour Top (no thermals): 32.65,28.22 27.58,32.19 27.57,32.33 33.33,30.05
  pour Top (no thermals): 32.65,28.22 43.43,24.05 arc185 44.61,27.53 33.11,30.16
OUT_A-
  Top 0.254: U1.6 27.58,32.77
  pour Top (no thermals): 33.15,32.75 33.15,32.75 27.56,32.82 27.56,32.7 32.87,30.73 43.53,28.83 arc186 43.99,32.51
OUT_B+
  Top 0.254: U1.8 27.59,33.77
  pour Top (no thermals): 33.02,38.1 27.58,33.85 27.58,33.71 33.28,35.92
  pour Top (no thermals): 33.02,38.1 43.38,41.94 arc-184 44.45,38.72 33.28,35.92
OUT_B-
  Top 0.254: U1.7 27.64,33.27
  pour Top (no thermals): 33.02,35.29 27.59,33.33 27.59,33.22 33.15,33.35
  pour Top (no thermals): 33.02,35.31 43.62,37.23 arc-192 43.89,33.6 33.17,33.35
RAW  (via drill 0.35)
  Top 1.27: 36.99,11.43 36.87,11.55
  Top 1.778: J3.2 36.99,11.43 | D1.A v20.2,17.9 22.86,15.24 24.13,15.24 | 24.13,15.24 35.56,15.24 36.87,13.93 36.87,11.55 J2.2 | J1.VIN0 23.11,5.84 24.13,6.86 24.13,15.24
  Bottom 0.508: D1BP.1 20.41,18.11 v20.2,17.9
VM
  Top 0.254: U1.3 25.65,30.32
  Top 0.406: U2.3 11.53,7.01 11.18,7.37 11.18,9.65 12.65,11.12 16.99,11.12 17.98,12.11 17.98,21.09 19.74,22.86 24.13,22.86 25.23,23.96 C2.+
  pour Top (no thermals): 23.84,24.64 23.84,28.69 25.72,30.58 26.64,29.66 26.64,28.38 28.47,26.54 28.47,25.5 28.45,25.48 26.64,24.64
VREF  (via drill 0.38)
  Top 0.203: U1.10 25.65,35.45 26.24,36.05 C4.1 26.24,37.84 26.85,38.44 28.59,38.44 29.21,39.06 VR1.2 29.21,41.1 v29.72,41.6
  Bottom 0.203: v29.72,41.6 36.83,48.72 J6.1

### Text on the board
Top: 1
GND2: 2
GND15: 3
Bottom: 4 | v10
Document: Selective Solder / Nozzle Width: 0.354"
tDocu: LAYER / NUMBERS | This is a 4-LAYER board! | Pete Lewis | 4-Layer Board